# EAGLE design new board p dan n (EAGLE 9.5.0)
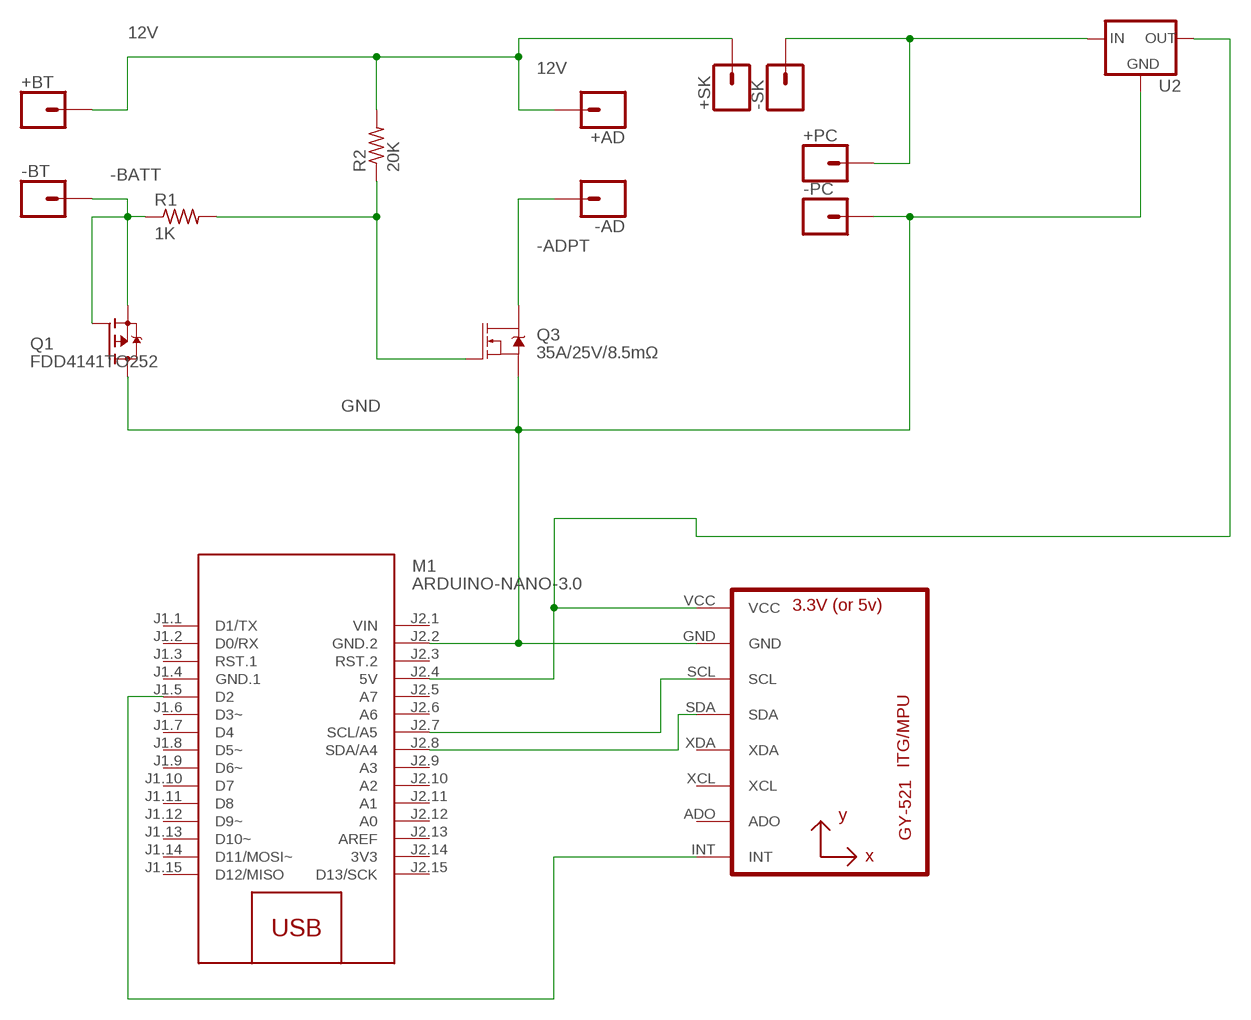
[diagram p0: schematic, sheet 1]

## Parts
+AD  CONN_01PTH_2MM  [1X01_2MM]
+BT  CONN_01PTH_2MM  [1X01_2MM]
+PC  CONN_01PTH_2MM  [1X01_2MM]
+SK  CONN_01PTH_2MM  [1X01_2MM]
-AD  CONN_01PTH_2MM  [1X01_2MM]
-BT  CONN_01PTH_2MM  [1X01_2MM]
-PC  CONN_01PTH_2MM  [1X01_2MM]
-SK  CONN_01PTH_2MM  [1X01_2MM]
M1  ARDUINO-NANO-3.0  [ARDUINO-NANO-3.0]
Q1  FDD4141TO252  [TO252]
Q3  35A/25V/8.5mΩ  MOSFET-NCH-FDD8780  [DPAK]
R1  1K  R-US_M1206  [M1206]
R2  20K  R-US_M1206  [M1206]
U1  GY-521MPU6050  [GY-521]
U2  +12v  V_REG_78XX7812  [TO-252]

## Nets
12V: +AD.1 +BT.1 +SK.1 R2.2
-ADPT: -AD.1 Q3.4(D)
-BATT: -BT.1 Q1.1(G) Q1.2(S) R1.1
GND: -PC.1 M1.J2.2(GND.2) Q1.3(D) Q3.3(S) U1.GND U2.3(GND)
N$2: +PC.1 -SK.1 U2.1(IN)
N$3: Q3.1(G) R1.2 R2.1
N$4: M1.J2.4(5V) U1.VCC U2.2(OUT)
N$6: M1.J2.8(SDA/A4) U1.SDA
N$7: M1.J2.7(SCL/A5) U1.SCL
N$8: M1.J1.5(D2) U1.INT
Unconnected: M1.J1.1(D1/TX) M1.J1.2(D0/RX) M1.J1.3(RST.1) M1.J1.6(D3~) M1.J1.7(D4) M1.J1.8(D5~) M1.J1.9(D6~) M1.J1.10(D7) M1.J1.11(D8) M1.J1.12(D9~) M1.J1.13(D10~) M1.J1.14(D11/MOSI~) M1.J1.15(D12/MISO) M1.J2.3(RST.2) M1.J2.5(A7) M1.J2.6(A6) M1.J2.9(A3) M1.J2.10(A2) M1.J2.11(A1) M1.J2.12(A0) M1.J2.13(AREF) M1.J2.15(D13/SCK) U1.ADO U1.XCL U1.XDA

## Power pins joined to a net without a drawn wire
3V3: M1.J2.14(3V3)
GND.1: M1.J1.4(GND.1)
VIN: M1.J2.1(VIN)

## Library data of the parts
+AD +BT +PC +SK -AD -BT -PC -SK = SparkFun-Connectors:CONN_01: Single connection point. Often used as Generic Header-pin footprint for 0.1 inch spaced/style header connections On any of the 0.1 inch spaced packages, you can populate with these: Break Away Headers - Straight <https://www.sparkfun.com/products/116> (PRT-00116) Break Away Male Headers - Right Angle <https://www.sparkfun.com/products/553> (PRT-00553) Female Headers <https://www.sparkfun.com/products/115> (PRT-00115) Break Away Headers - Machine Pin <https://www.sparkfun.com/products/117> (PRT-00117) Break Away Female Headers - Swiss Machine Pin <https://www.sparkfun.com/products/743> (PRT-00743) This device is also useful as a general connection point to wire up your design to another part of your project. Our various solder wires solder well into these plated through hole pads. Hook-Up Wire - Assortment (Stranded, 22 AWG) <https://www.sparkfun.com/products/11375> (PRT-11375) Hook-Up Wire - Assortment (Solid Core, 22 AWG) <https://www.sparkfun.com/products/11367> (PRT-11367) View the entire wire category on our website here <https://www.sparkfun.com/categories/141> Special notes: SMTSO-256-ET is a "flush mount" nut for a 4-40 screw. We mostly use this on specialty testbeds; it is a nice way to connect hardware to your PCB at an adjustable hieght. Also note, the SNAP packages are for using a snappable style connector. We sell a baggie of snaps and they are also used on two LilyPad designs: Snap Assortment - 30 pack (male and female) <https://www.sparkfun.com/products/11347> (DEV-11347) LilyPad Arduino SimpleSnap <https://www.sparkfun.com/products/10941> (DEV-10941) LilyPad SimpleSnap Protoboard <https://www.sparkfun.com/products/10940> (DEV-10940)
M1 = diy-modules:ARDUINO-NANO-3.0: Arduino Nano 3.0 and compatible devices More details available here: https://www.arduino.cc/en/Main/ArduinoBoardNano Click here to find device on ebay.com <http://www.ebay.com/sch/arduino+nano>
Q1 = transistor-fet:FDD4141: P-Channel PowerTrench® MOSFET Source: FDD4141.pdf
Q3 = SparkFun-DiscreteSemi:MOSFET-NCH: N-channel MOSFETs Voltage controlled devices that allow control of high current outputs. SparkFun Products: SparkFun OpenScale <https://www.sparkfun.com/products/13261> SparkFun Digital Sandbox <https://www.sparkfun.com/products/12651> SparkFun Monster Moto Shield <https://www.sparkfun.com/products/10182> SparkFun MOSFET Power Controller <https://www.sparkfun.com/products/11214>; PROD_ID: TRANS-09984
R1 R2 = rcl:R-US_: RESISTOR, American symbol; SPICEPREFIX: R
U1 = gy-521:GY-521
U2 = SparkFun-IC-Power:V_REG_78XX: Voltage Regulator Standard 78xx regulator. IGO (Input Ground Output). Spark Fun Electronics SKU : COM-00107; PROD_ID: VREG-12370

## Board
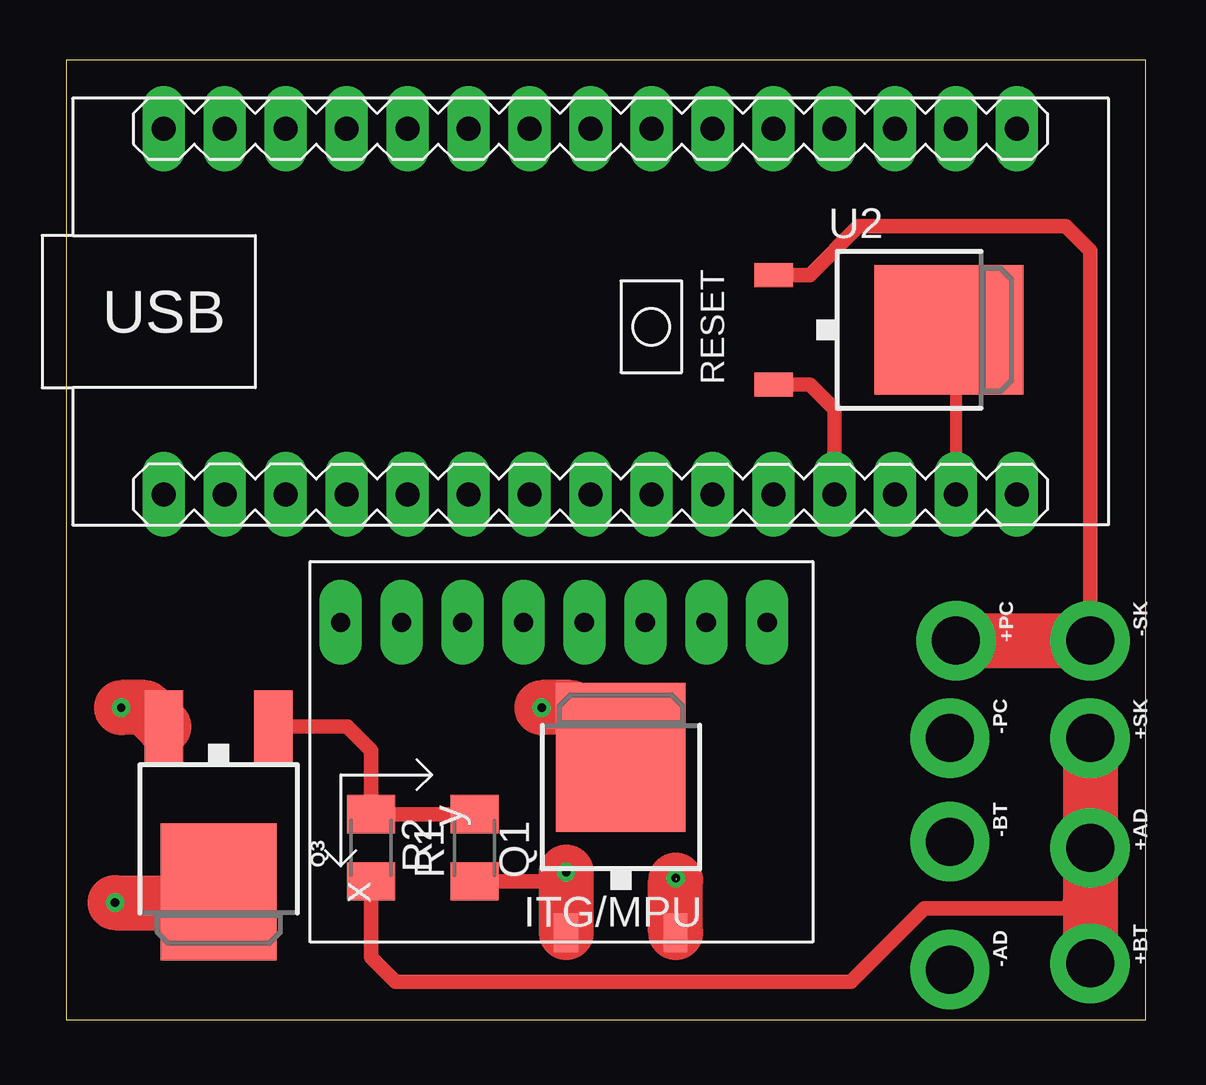
[diagram p1: board, top side]
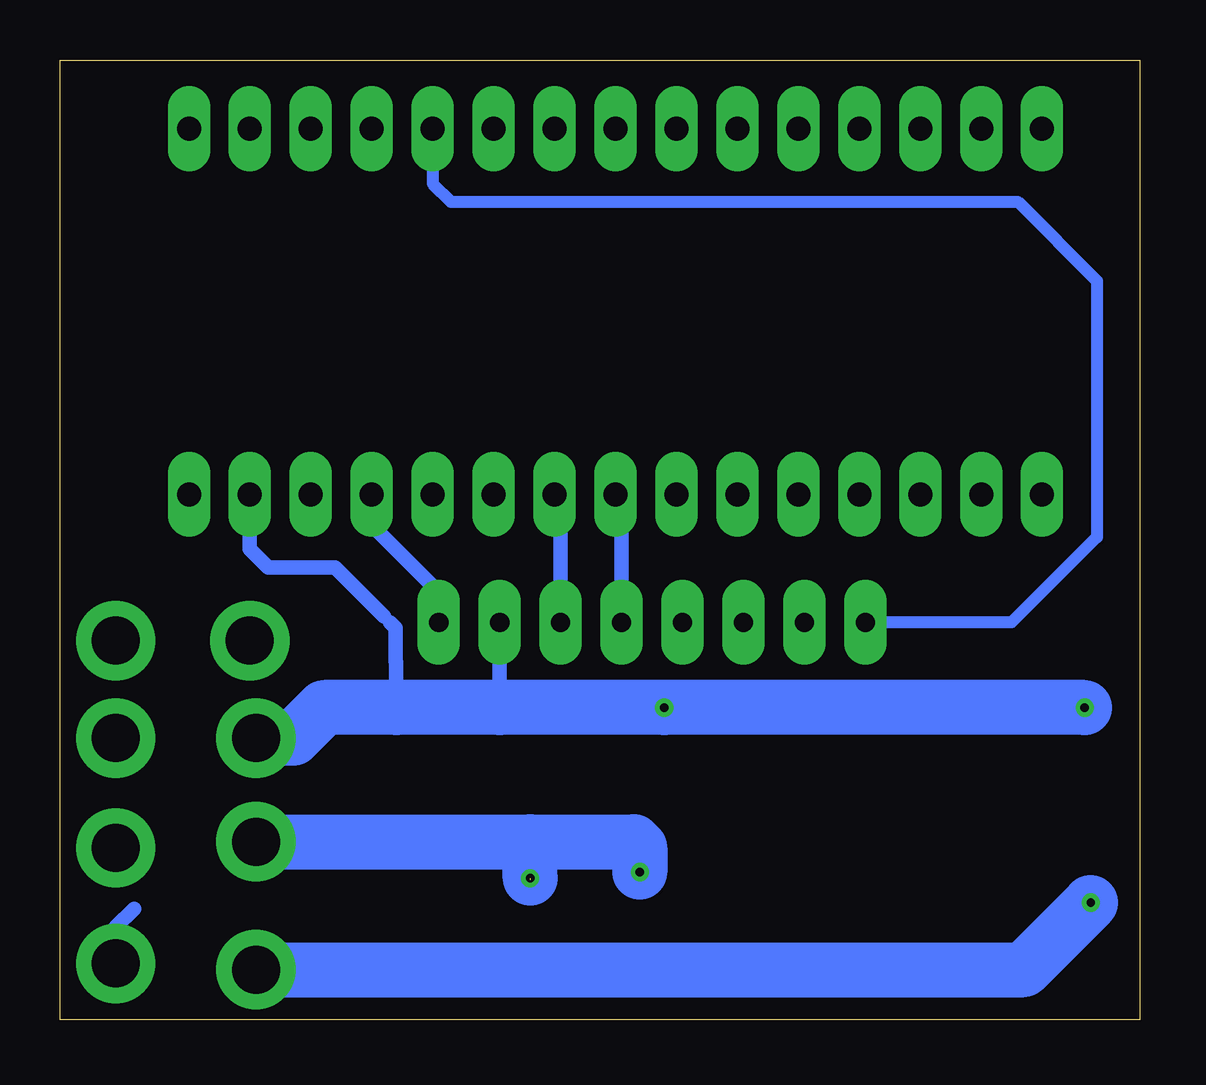
[diagram p2: board, bottom side, seen from below]

Size 45 x 40 mm. Coordinates in mm from the lower left corner, seen from the top.
Outline: 0,0 45,0 45,40 0,40 0,0
Copper layers (1*16): Top 0.035mm / dielectric 1.5mm / Bottom 0.035mm
Design rules "default": minimum track width 6mil, minimum drill 0.35mm, track to track 24mil, track to pad 24mil, pad to pad 24mil, via to via 24mil, smd to smd 24mil, copper to edge 40mil, drill to drill 6mil, minimum pad ring 10mil, minimum via ring 8mil, stop-mask expansion 4mil, vias tented up to drill 0mil, thermal gap 10mil

### Footprints (pad centres in the part's own frame; a part is rotated, then mirrored left to right if it is on the bottom)
1X01_2MM = drill 2 pad 3.302: 1 0,0
ARDUINO-NANO-3.0 = drill 1 pad 1.778 long: J1.1 17.78,7.62; J1.2 15.24,7.62; J1.3 12.7,7.62; J1.4 10.16,7.62; J1.5 7.62,7.62; J1.6 5.08,7.62; J1.7 2.54,7.62; J1.8 0,7.62; J1.9 -2.54,7.62; J1.10 -5.08,7.62; J1.11 -7.62,7.62; J1.12 -10.16,7.62; J1.13 -12.7,7.62; J1.14 -15.24,7.62; J1.15 -17.78,7.62; J2.1 17.78,-7.62; J2.2 15.24,-7.62; J2.3 12.7,-7.62; J2.4 10.16,-7.62; J2.5 7.62,-7.62; J2.6 5.08,-7.62; J2.7 2.54,-7.62; J2.8 0,-7.62; J2.9 -2.54,-7.62; J2.10 -5.08,-7.62; J2.11 -7.62,-7.62; J2.12 -10.16,-7.62; J2.13 -12.7,-7.62; J2.14 -15.24,-7.62; J2.15 -17.78,-7.62
TO252 = smd 1 x 1.6: 1 -2.28,-4.8; 2 2.28,-4.8 | smd 5.4 x 6.2: 3 0,2.5
DPAK = smd 1.6 x 3: 1 -2.28,-5.31; 3 2.28,-5.31 | smd 4.826 x 5.715: 4 0,1.588
M1206 = smd 1.6 x 2: 1 -1.4,0; 2 1.4,0
GY-521 = drill 0.8 pad 1.778 long: ADO -8.89,-6.35; GND -8.89,6.35; INT -8.89,-8.89; SCL -8.89,3.81; SDA -8.89,1.27; VCC -8.89,8.89; XCL -8.89,-3.81; XDA -8.89,-1.27
TO-252 = smd 1 x 1.6: 1 -2.28,-4.8; 2 2.28,-4.8 | smd 5.4 x 6.2: 3 0,2.5

### Placement (x,y rotation side)
+AD  42.67,7.16 270 top
+BT  42.67,2.33 270 top
+PC  37.08,15.8 270 top
+SK  42.67,11.73 270 top
-AD  36.83,2.08 270 top
-BT  36.83,7.41 270 top
-PC  36.83,11.73 270 top
-SK  42.67,15.8 270 top
M1  21.84,29.51 0 top
Q1  23.11,8.43 0 top
Q3  6.35,6.91 180 top
R1  17.02,7.16 90 top
R2  12.7,7.16 270 top
U1  20.32,7.67 270 top
U2  34.29,28.75 270 top

### Tracks (layer width: path | path; a pad name or v marks a point on that pad's centre or on a via)
12V
  Top 0.61: R2.2 12.7,2.59 13.72,1.57 26.25,1.57 26.26,1.57 32.69,1.57 35.77,4.64 42.44,4.64 42.67,4.87
  Top 2.3: +SK.1 +AD.1 42.67,4.87 +BT.1
  Bottom 0.61: +BT.1 42.67,3.86 41.91,4.62
-ADPT  (via drill 0.35)
  Top 2.3: v2.03,4.87 6.6,4.87 6.6,5.06 Q3.4
  Bottom 2.3: -AD.1 4.83,2.08 v2.03,4.87
-BATT  (via drill 0.35)  (1 unrouted)
  Top 0.61: R1.1 20.46,5.76 v20.83,6.14
  Top 2.3: v20.83,6.14 Q1.1 | Q1.2 25.39,5.81 25.4,5.82
  Bottom 2.3: -BT.1 25.4,7.41 | 25.4,7.41 21.08,7.41 20.83,7.16 v20.83,6.14 | v25.4,5.89 25.4,7.41
GND  (via drill 0.35)
  Top 0.508: 37.08,28.46 M1.J2.2
  Top 0.61: U2.3 37.08,28.46
  Top 2.3: Q3.3 3.28,13 v2.29,13 | Q1.3 21.04,13 v19.81,13
  Bottom 0.508: 31.5,16.81 31.24,16.56
  Bottom 0.61: M1.J2.2 37.08,19.61 36.32,18.84 33.53,18.84 31.5,16.81 | U1.GND 26.67,13 | 31.24,16.56 31.01,16.33 31.01,14.92 30.99,14.9 30.99,13
  Bottom 2.3: -PC.1 35.27,11.73 34,13 30.99,13 26.67,13 v19.81,13 v2.29,13
N$2
  Top 0.61: -SK.1 42.67,32.05 41.66,33.07 33.02,33.07 30.98,31.03 U2.1
  Top 2.3: +PC.1 -SK.1
N$3
  Top 0.61: R1.2 R2.1 12.7,11.22 11.71,12.22 Q3.1
N$4
  Top 0.61: U2.2 30.98,26.47 32,25.45 M1.J2.4
  Bottom 0.61: M1.J2.4 32,20.62 29.21,17.83 U1.VCC
N$6
  Bottom 0.61: M1.J2.8 21.59,21.64 U1.SDA
N$7
  Bottom 0.61: M1.J2.7 24.13,21.64 U1.SCL
N$8
  Bottom 0.508: M1.J1.5 29.46,34.85 28.7,34.08 5.08,34.08 1.78,30.78 1.78,20.11 5.33,16.56 U1.INT